# Altium schematic sheet FullyDifferentialOpAmps.SchDoc
size A4; SheetNumber: 2; SheetTotal: 7; SPICEModelCacheMURSBSRZ: <root> / <DocumentId>MURSBSRZ</DocumentId> / </root>
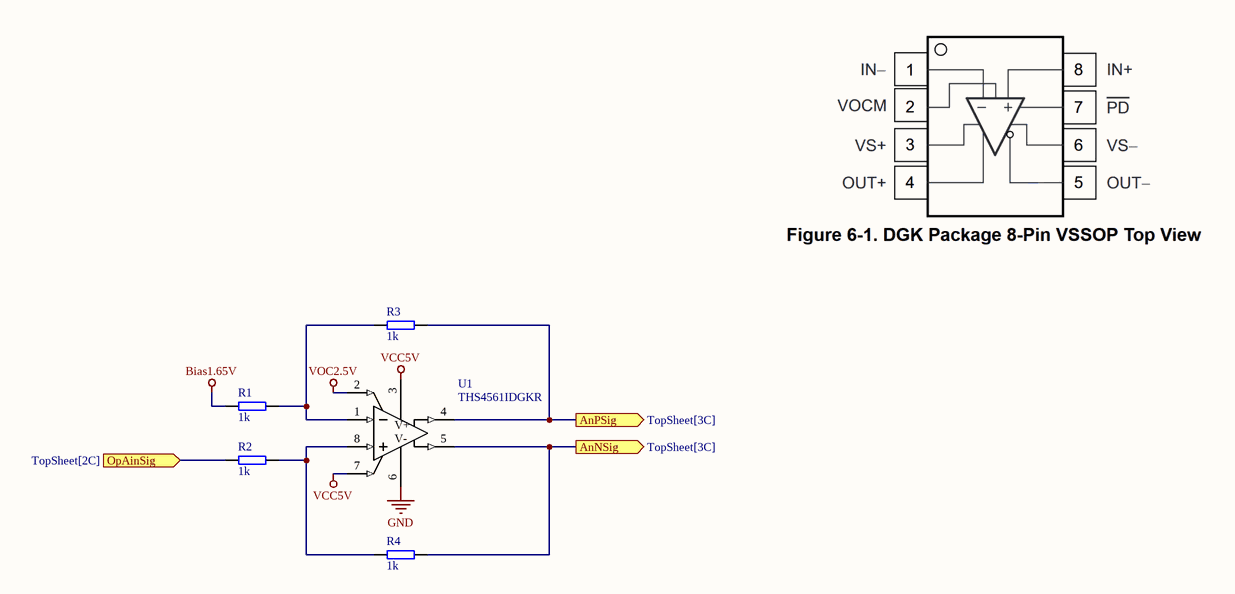
[diagram p0: FullyDifferentialOpAmps.SchDoc]

## Parts
R1  1k  [RES 0603_1608]
R2  1k  [RES 0603_1608]
R3  1k  [RES 0603_1608]
R4  1k  [RES 0603_1608]
U1  THS4561IDGKR  [DGK0008A_N]

## Ports
AnNSig (out, see TopSheet[3C]), AnPSig (out, see TopSheet[3C]), OpAinSig (in, see TopSheet[2C])

## Nets
Bias1.65V: R1.1
GND: U1.6(VS-)
VCC5V: U1.3(VS+) U1.7(PD_N)
VOC2.5V: U1.2(VOCM)
AnNSig: R4.2 U1.5(VOUT-) ; port AnNSig
AnPSig: R3.2 U1.4(VOUT+) ; port AnPSig
OpAinSig: R2.1 ; port OpAinSig
NetR1_2: R1.2 R3.1 U1.1(VIN-)
NetR2_2: R2.2 R4.1 U1.8(VIN+)

## Notes on the sheet
- (in symbol CMP-020-000001-1) V+; V-

## Library data of the parts
R1-R4 = 0603WAF1001T5E: SMD resistor E24 series; Manufacturer: UNI-ROYAL; Tolerance: 1%; Created from: AGeiger; Manufacturer Part Number: 0603WAF1001T5E; PartID: 74; Created On: 14/12/2020 16:17:14; ComponentLink1Description: Datasheet; ComponentLink1URL: https://datasheet.lcsc.com/lcsc/2206010130_UNI-ROYAL-Uniroyal-Elec-0603WAF1001T5E_C21190.pdf; Component Type: SMD resistor; Device Package: 0603; Last Updated: 25/08/2022 16:01:46; Mounting Type: SMD; Supplier 1: LCSC; Supplier Part Number 1: C21190; Type: Resistor; Value: 1k; Live Cycle Status: 1; Stock number: Labor SMD Container; LCSC Part Number: C21190
U1 = CMP-020-000001-1: No Description Available; Mfr_Name: Texas Instruments; TYPE: TYPE; Source: THS4561IDGKR.SchLib; RefDes: RefDes; Design Item ID: THS4561IDGKR